# Altium schematic sheet ENC28j60 Ethernet.SchDoc
size A
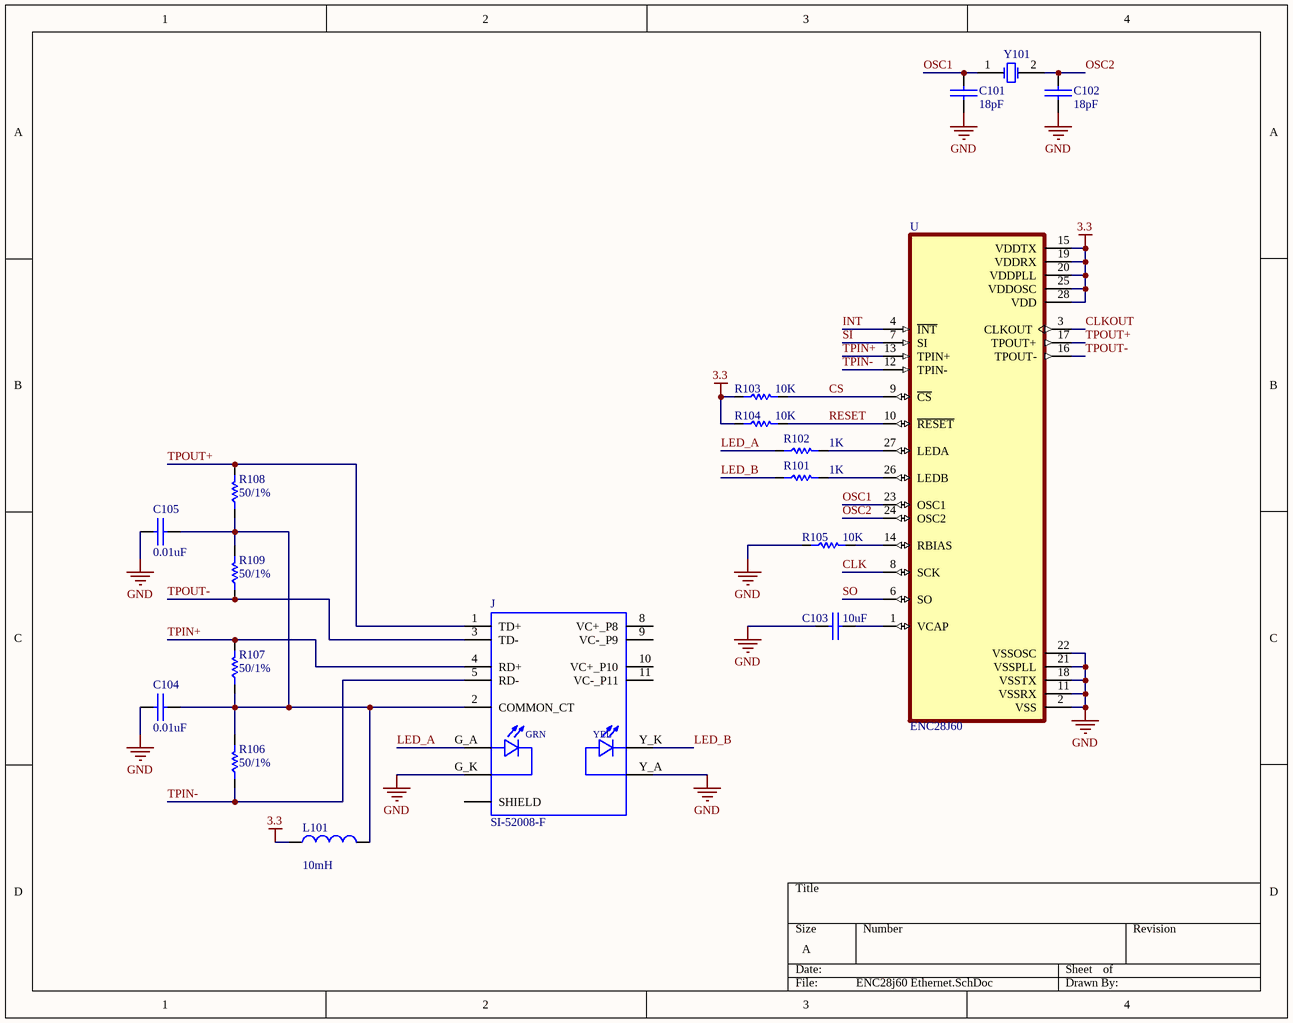
[diagram p0: ENC28j60 Ethernet.SchDoc]

## Parts
C101  18pF  [SMD_CAP_0805]
C102  18pF  [SMD_CAP_0805]
C103  10uF  [SMD_CAP_0805]
C104  0.01uF  [SMD_CAP_0805]
C105  0.01uF  [SMD_CAP_0805]
J  SI-52008-F  [BEL_SI-52008-F]
L101  value 10mH  [INDC1608L]  (hidden comment: Inductor)
R101  1K  [RES 0805 (2012X06L)]
R102  1K  [RES 0805 (2012X06L)]
R103  10K  [RES 0805 (2012X06L)]
R104  10K  [RES 0805 (2012X06L)]
R105  10K  [RES 0805 (2012X06L)]
R106  50/1%  [RES 0805 (2012X06L)]
R107  50/1%  [RES 0805 (2012X06L)]
R108  50/1%  [RES 0805 (2012X06L)]
R109  50/1%  [RES 0805 (2012X06L)]
U  ENC28J60  [SOIC127P1030X265-28N]
Y101  11.0592 MHz  [Crystal SMD]  (value not drawn)

## Nets
3.3: L101.1 R103.1 R104.1 U.15(VDDTX) U.19(VDDRX) U.20(VDDPLL) U.25(VDDOSC) U.28(VDD)
GND: C101.2(-) C102.2(-) C103.1(+) C104.1(+) C105.1(+) J.G_K J.Y_A R105.1 U.2(VSS) U.11(VSSRX) U.18(VSSTX) U.21(VSSPLL) U.22(VSSOSC)
CLK: U.8(SCK)
CLKOUT: U.3(CLKOUT)
CS: R103.2 U.9(~{CS})
INT: U.4(~{INT})
LED_A: J.G_A R102.1
LED_B: J.Y_K R101.1
OSC1: C101.1(+) U.23(OSC1) Y101.1(OSC1)
OSC2: C102.1(+) U.24(OSC2) Y101.2(OSC2)
RESET: R104.2 U.10(~{RESET})
SI: U.7(SI)
SO: U.6(SO)
TPIN+: J.4(RD+) R107.2 U.13(TPIN+)
TPIN-: J.5(RD-) R106.1 U.12(TPIN-)
TPOUT+: J.1(TD+) R108.2 U.17(TPOUT+)
TPOUT-: J.3(TD-) R109.1 U.16(TPOUT-)
NetC103_2: C103.2(-) U.1(VCAP)
NetC104_2: C104.2(-) C105.2(-) J.2(COMMON_CT) L101.2 R106.2 R107.1 R108.1 R109.2
NetJ_S1: J.S1(SHIELD) J.S2(SHIELD)
NetR101_2: R101.2 U.26(LEDB)
NetR102_2: R102.2 U.27(LEDA)
NetR105_2: R105.2 U.14(RBIAS)

Not connected (* = marked no-connect by the designer): J 8(VC+_P8) 9(VC-_P9) 10(VC+_P10) 11(VC-_P11)

## Notes on the sheet
- (in symbol SI-52008-F) GRN; YEL

## Library data of the parts
C101-C105 = Cap-Bipolar: Bipolar Capacitor; Voltage: 100V; Designer: Saeid Jorablo; Organazation: ControTec; Adding Date: 1387/12/20
  C101 C102: Value: 18pF
  C103: Value: 10uF
  C104 C105: Value: 0.01uF
J = SI-52008-F: 1 Port RJ45 Magjack Connector Through Hole 10/100 Base-T, AutoMDIX, Power over Ethernet _PoE_; MF: Stewart Connector; Availability: Unavailable; MP: SI-52008-F; Price: None; Value: *; SnapEDA_Link: https://www.snapeda.com/parts/SI-52008-F/Stewart%20Connector/view-part/214280/?ref=snap; Package: None
L101 = Inductor: Code_IEC: 1005; Published: 8-Jun-2000; LatestRevisionDate: 29-May-2009; LatestRevisionNote: IPC-7351 Footprint Added.; PackageReference: 0402-A; Publisher: Altium Limited; PackageDescription: Chip Inductor; Code_JEITA: 0402
R101-R109 = Resistor: Tolerance: 5%; Power: 1/8 W
  R101 R102: Value: 1K
  R103-R105: Value: 10K
  R106-R109: Value: 50/1%
U = ENC28J60: Ethernet Controller 10 Base-T PHY SPI Interface 28-SSOP; MF: Microchip; MP: ENC28J60; Availability: Unavailable; Package: SSOP Microchip; Value: *; Price: None; SnapEDA_Link: https://www.snapeda.com/parts/ENC28J60/Microchip/view-part/105825/?ref=snap
Y101 = XTAL: XTAL Crystal; Company: E.P.I.L; Design Date: 11/04/2011; Value: 11.0592 MHz